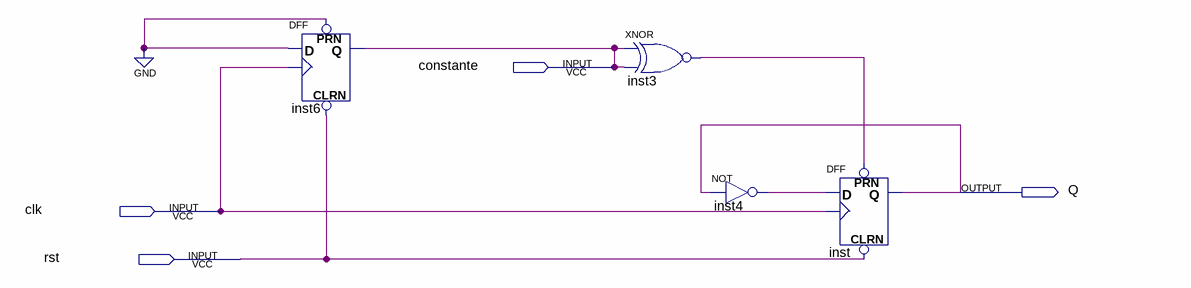
[diagram p0: schematic sheet]
// Quartus schematic BlocoTempo.bdf as structural Verilog: 4 symbols, 4 pins
module BlocoTempo (
  input  constante,
  input  clk,
  input  rst,
  output Q
);

  wire inst3_out, inst4_out;

  DFF inst6 (.CLRN(rst), .CLK(clk), .D(1'b0), .PRN(1'b0), .Q(constante));
  xnor inst3 (inst3_out, constante, constante);
  not inst4 (inst4_out, Q);
  DFF inst (.CLRN(rst), .CLK(clk), .D(inst4_out), .PRN(inst3_out), .Q(Q));
endmodule
